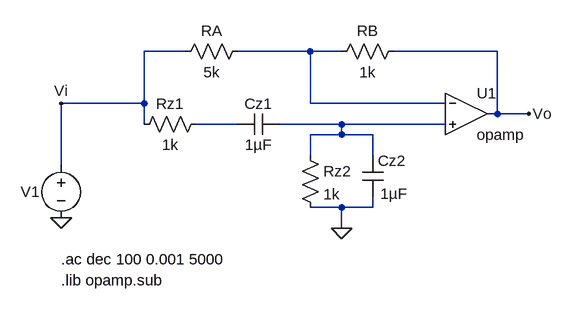
[diagram p0: schematic ejercicio7_pasatodo2.asc]
ejercicio7_pasatodo2.asc, the LTspice schematic file:
Version 4
SHEET 1 1200 800
WIRE 288 256 224 256
WIRE 480 256 368 256
WIRE 528 256 480 256
WIRE 768 256 608 256
WIRE 224 336 224 256
WIRE 224 336 96 336
WIRE 480 336 480 256
WIRE 688 336 480 336
WIRE 768 352 768 256
WIRE 768 352 752 352
WIRE 816 352 768 352
WIRE 224 368 224 336
WIRE 368 368 304 368
WIRE 528 368 432 368
WIRE 688 368 528 368
WIRE 528 384 528 368
WIRE 528 384 480 384
WIRE 576 384 528 384
WIRE 480 416 480 384
WIRE 576 416 576 384
WIRE 96 432 96 336
WIRE 528 496 480 496
WIRE 576 496 576 480
WIRE 576 496 528 496
WIRE 528 528 528 496
FLAG 96 512 0
FLAG 96 336 Vi
FLAG 816 352 Vo
FLAG 528 528 0
SYMBOL voltage 96 416 R0
WINDOW 3 24 96 Invisible 2
WINDOW 0 -62 56 Left 2
SYMATTR Value ""
SYMATTR InstName V1
SYMATTR Value2 AC 1 0
SYMBOL res 384 240 R90
WINDOW 0 0 56 VBottom 2
WINDOW 3 32 56 VTop 2
SYMATTR InstName RA
SYMATTR Value 5k
SYMBOL res 624 240 R90
WINDOW 0 0 56 VBottom 2
WINDOW 3 32 56 VTop 2
SYMATTR InstName RB
SYMATTR Value 1k
SYMBOL res 320 352 R90
WINDOW 0 0 56 VBottom 2
WINDOW 3 32 56 VTop 2
SYMATTR InstName Rz1
SYMATTR Value 1k
SYMBOL cap 432 352 R90
WINDOW 0 0 32 VBottom 2
WINDOW 3 32 32 VTop 2
SYMATTR InstName Cz1
SYMATTR Value 1µF
SYMBOL res 464 400 R0
SYMATTR InstName Rz2
SYMATTR Value 1k
SYMBOL cap 560 416 R0
WINDOW 3 28 59 Left 2
SYMATTR InstName Cz2
SYMATTR Value 1µF
SYMBOL OpAmps/opamp 720 288 R0
SYMATTR InstName U1
TEXT 96 576 Left 2 !.ac dec 100 0.001 5000
TEXT 96 608 Left 2 !.lib opamp.sub

The netlist it stands for:
* ejercicio7_pasatodo2.asc
V1 Vi 0 AC 1 0
RA N001 Vi 5k
RB Vo N001 1k
Rz1 N002 Vi 1k
Cz1 N003 N002 1µF
Rz2 N003 0 1k
Cz2 N003 0 1µF
XU1 N001 N003 Vo opamp Aol=100K GBW=10Meg  ; pins invin noninvin out
.ac dec 100 0.001 5000
.lib opamp.sub
.backanno
.end